# EAGLE design line_sensor (EAGLE 9.6.0)
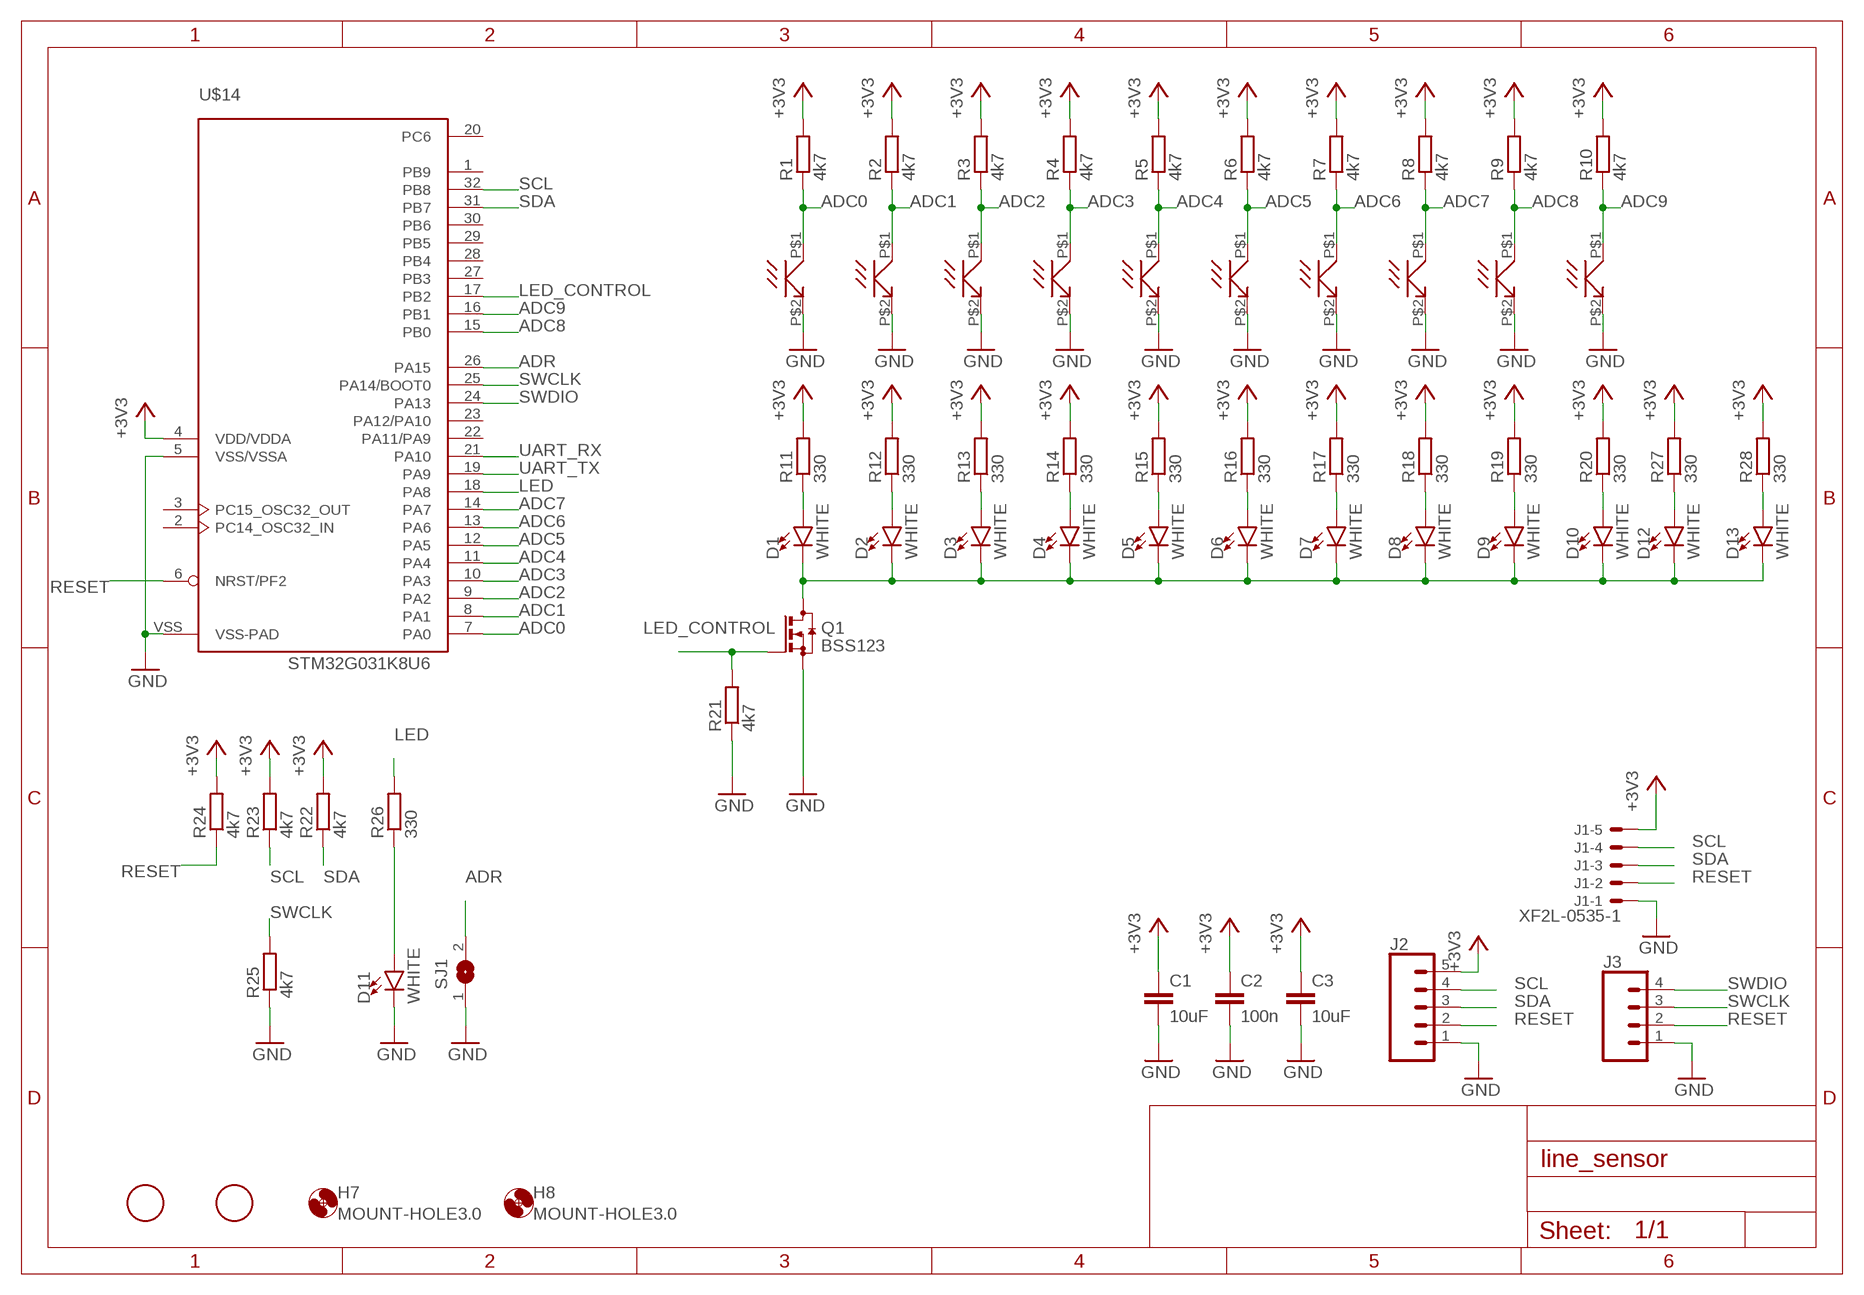
[diagram p0: schematic, sheet 1]

## Parts
C1  10uF  C-EUC0805K  [C0805K]
C2  100n  C-EUC0805K  [C0805K]
C3  10uF  C-EUC0805K  [C0805K]
D1  WHITE  LED-WHITE1206  [LED-1206]
D2  WHITE  LED-WHITE1206  [LED-1206]
D3  WHITE  LED-WHITE1206  [LED-1206]
D4  WHITE  LED-WHITE1206  [LED-1206]
D5  WHITE  LED-WHITE1206  [LED-1206]
D6  WHITE  LED-WHITE1206  [LED-1206]
D7  WHITE  LED-WHITE1206  [LED-1206]
D8  WHITE  LED-WHITE1206  [LED-1206]
D9  WHITE  LED-WHITE1206  [LED-1206]
D10  WHITE  LED-WHITE1206  [LED-1206]
D11  WHITE  LED-WHITE1206  [LED-1206]
D12  WHITE  LED-WHITE1206  [LED-1206]
D13  WHITE  LED-WHITE1206  [LED-1206]
H7  MOUNT-HOLE3.0  [3,0]
H8  MOUNT-HOLE3.0  [3,0]
J1  XF2L-0535-1  [XF2L-0535-1]
J2  CONN_05  [1X05]
J3  CONN_04LOCK  [1X04_LOCK]
Q1  BSS123  [SOT23]
R1  4k7  R-EU_M0805  [M0805]
R2  4k7  R-EU_M0805  [M0805]
R3  4k7  R-EU_M0805  [M0805]
R4  4k7  R-EU_M0805  [M0805]
R5  4k7  R-EU_M0805  [M0805]
R6  4k7  R-EU_M0805  [M0805]
R7  4k7  R-EU_M0805  [M0805]
R8  4k7  R-EU_M0805  [M0805]
R9  4k7  R-EU_M0805  [M0805]
R10  4k7  R-EU_M0805  [M0805]
R11  330  R-EU_M0805  [M0805]
R12  330  R-EU_M0805  [M0805]
R13  330  R-EU_M0805  [M0805]
R14  330  R-EU_M0805  [M0805]
R15  330  R-EU_M0805  [M0805]
R16  330  R-EU_M0805  [M0805]
R17  330  R-EU_M0805  [M0805]
R18  330  R-EU_M0805  [M0805]
R19  330  R-EU_M0805  [M0805]
R20  330  R-EU_M0805  [M0805]
R21  4k7  R-EU_M0805  [M0805]
R22  4k7  R-EU_M0805  [M0805]
R23  4k7  R-EU_M0805  [M0805]
R24  4k7  R-EU_M0805  [M0805]
R25  4k7  R-EU_M0805  [M0805]
R26  330  R-EU_M0805  [M0805]
R27  330  R-EU_M0805  [M0805]
R28  330  R-EU_M0805  [M0805]
SJ1  SJ  [SJ]
U$1  SFH3710  [SFH710]
U$2  SFH3710  [SFH710]
U$3  SFH3710  [SFH710]
U$4  SFH3710  [SFH710]
U$5  SFH3710  [SFH710]
U$6  SFH3710  [SFH710]
U$7  SFH3710  [SFH710]
U$8  SFH3710  [SFH710]
U$9  SFH3710  [SFH710]
U$10  SFH3710  [SFH710]
U$12  FIDUCIAL  [FIDUCIAL_1MM]
U$13  FIDUCIAL  [FIDUCIAL_1MM]
U$14  STM32G031K8U6  [UFQFPN32]

## Nets
+3V3: C1.1 C2.1 C3.1 J1.5 J2.5 R1.2 R2.2 R3.2 R4.2 R5.2 R6.2 R7.2 R8.2 R9.2 R10.2 R11.2 R12.2 R13.2 R14.2 R15.2 R16.2 R17.2 R18.2 R19.2 R20.2 R22.2 R23.2 R24.2 R27.2 R28.2 U$14.4(VDD/VDDA)
ADC0: R1.1 U$1.P$1(C) U$14.7(PA0)
ADC1: R2.1 U$2.P$1(C) U$14.8(PA1)
ADC2: R3.1 U$3.P$1(C) U$14.9(PA2)
ADC3: R4.1 U$4.P$1(C) U$14.10(PA3)
ADC4: R5.1 U$5.P$1(C) U$14.11(PA4)
ADC5: R6.1 U$6.P$1(C) U$14.12(PA5)
ADC6: R7.1 U$7.P$1(C) U$14.13(PA6)
ADC7: R8.1 U$8.P$1(C) U$14.14(PA7)
ADC8: R9.1 U$9.P$1(C) U$14.15(PB0)
ADC9: R10.1 U$10.P$1(C) U$14.16(PB1)
ADR: SJ1.2 U$14.26(PA15)
GND: C1.2 C2.2 C3.2 D11.C J1.1 J2.1 J3.1 Q1.2(S) R21.1 R25.1 SJ1.1 U$1.P$2(E) U$2.P$2(E) U$3.P$2(E) U$4.P$2(E) U$5.P$2(E) U$6.P$2(E) U$7.P$2(E) U$8.P$2(E) U$9.P$2(E) U$10.P$2(E) U$14.5(VSS/VSSA) U$14.VSS(VSS-PAD)
LED: R26.2 U$14.18(PA8)
LED_CONTROL: Q1.1(G) R21.2 U$14.17(PB2)
N$1: D1.A R11.1
N$2: D2.A R12.1
N$3: D3.A R13.1
N$4: D4.A R14.1
N$5: D5.A R15.1
N$6: D6.A R16.1
N$7: D7.A R17.1
N$8: D8.A R18.1
N$9: D9.A R19.1
N$10: D10.A R20.1
N$11: D1.C D2.C D3.C D4.C D5.C D6.C D7.C D8.C D9.C D10.C D12.C D13.C Q1.3(D)
N$12: D11.A R26.1
N$13: D12.A R27.1
N$14: D13.A R28.1
RESET: J1.2 J2.2 J3.2 R24.1 U$14.6(NRST/PF2)
SCL: J1.4 J2.4 R23.1 U$14.32(PB8)
SDA: J1.3 J2.3 R22.1 U$14.31(PB7)
SWCLK: J3.3 R25.2 U$14.25(PA14/BOOT0)
SWDIO: J3.4 U$14.24(PA13)
UART_RX: U$14.21(PA10)
UART_TX: U$14.19(PA9)
Unconnected: U$14.1(PB9) U$14.2(PC14_OSC32_IN) U$14.3(PC15_OSC32_OUT) U$14.20(PC6) U$14.22(PA11/PA9) U$14.23(PA12/PA10) U$14.27(PB3) U$14.28(PB4) U$14.29(PB5) U$14.30(PB6)

## Library data of the parts
C1-C3 = rcl:C-EU: CAPACITOR, European symbol; SPICEPREFIX: C
D1-D13 = SparkFun-LED:LED-WHITE: White SMD LED Used in manufacturing several products at SparkFun. Packages: 0603 - Bright White SMD 0603 package[Product Link] <http://www.kingbrightusa.com/product.asp?catalog_name=LED&product_id=APT1608QWF/D> 1206 - Bright White SMD1206 package [Product Link] <http://www.kingbrightusa.com/product.asp?catalog_name=LED&product_id=APT3216QWF/D> 3014 - Super Bright SMD 3014 package [Datasheet] <http://www.lumileds.com/uploads/459/DS208-pdf> SparkFun Products: Blackberry Trackballer Breakout <https://www.sparkfun.com/products/13169> Digital SandBox <https://www.sparkfun.com/products/12651>; PROD_ID: DIO-09955
H7 H8 = holes:MOUNT-HOLE: MOUNTING HOLE with drill center marker
J1 = con-omron:XF2*-05?: OMRON FPC Connector Source : http://www.omron.com/ecb/products/pdf/fpc.pdf; MPN: XF2L-0535-1A; OC_FARNELL: unknown; OC_NEWARK: 37M0863
J2 = SparkFun-Connectors:CONN_05: Multi connection point. Often used as Generic Header-pin footprint for 0.1 inch spaced/style header connections On any of the 0.1 inch spaced packages, you can populate with these: Break Away Headers - Straight <https://www.sparkfun.com/products/116> (PRT-00116) Break Away Male Headers - Right Angle <https://www.sparkfun.com/products/553> (PRT-00553) Female Headers <https://www.sparkfun.com/products/115> (PRT-00115) Break Away Headers - Machine Pin <https://www.sparkfun.com/products/117> (PRT-00117) Break Away Female Headers - Swiss Machine Pin <https://www.sparkfun.com/products/743> (PRT-00743) For SCREWTERMINALS and SPRING TERMINALS visit here: Screw Terimnals on SparkFun.com <https://www.sparkfun.com/search/results?term=Screw+Terminals> (5mm/3.5mm/2.54mm spacing) This device is also useful as a general connection point to wire up your design to another part of your project. Our various solder wires solder well into these plated through hole pads. Hook-Up Wire - Assortment (Stranded, 22 AWG) <https://www.sparkfun.com/products/11375> (PRT-11375) Hook-Up Wire - Assortment (Solid Core, 22 AWG) <https://www.sparkfun.com/products/11367> (PRT-11367) View the entire wire category on our website here <https://www.sparkfun.com/categories/141> Special notes: Molex polarized connector foot print use with SKU : PRT-08231 with associated crimp pins and housings. 1MM SMD Version SKU: PRT-10208
J3 = SparkFun-Connectors:CONN_04: Multi connection point. Often used as Generic Header-pin footprint for 0.1 inch spaced/style header connections On any of the 0.1 inch spaced packages, you can populate with these: Break Away Headers - Straight <https://www.sparkfun.com/products/116> (PRT-00116) Break Away Male Headers - Right Angle <https://www.sparkfun.com/products/553> (PRT-00553) Female Headers <https://www.sparkfun.com/products/115> (PRT-00115) Break Away Headers - Machine Pin <https://www.sparkfun.com/products/117> (PRT-00117) Break Away Female Headers - Swiss Machine Pin <https://www.sparkfun.com/products/743> (PRT-00743) For SCREWTERMINALS and SPRING TERMINALS visit here: Screw Terimnals on SparkFun.com <https://www.sparkfun.com/search/results?term=Screw+Terminals> (5mm/3.5mm/2.54mm spacing) This device is also useful as a general connection point to wire up your design to another part of your project. Our various solder wires solder well into these plated through hole pads. Hook-Up Wire - Assortment (Stranded, 22 AWG) <https://www.sparkfun.com/products/11375> (PRT-11375) Hook-Up Wire - Assortment (Solid Core, 22 AWG) <https://www.sparkfun.com/products/11367> (PRT-11367) View the entire wire category on our website here <https://www.sparkfun.com/categories/141> Special notes: Molex polarized connector foot print use with SKU : PRT-08231 with associated crimp pins and housings. 1MM SMD Version SKU: PRT-10208; PROD_ID: CONN-09696
Q1 = transistor-small-signal:BSS123: N-CHANNEL MOS FET
R1-R28 = rcl:R-EU_: RESISTOR, European symbol; SPICEPREFIX: R
SJ1 = jumper:SJ: SMD solder JUMPER
U$1-U$10 = my_library:SFH3710
U$12 U$13 = borkedlabs-misc:FIDUCIAL: For use by pick and place machines to calibrate the vision/machine, 1mm By microbuilder.eu
U$14 = my_library:STM32G031K8U6

## Board
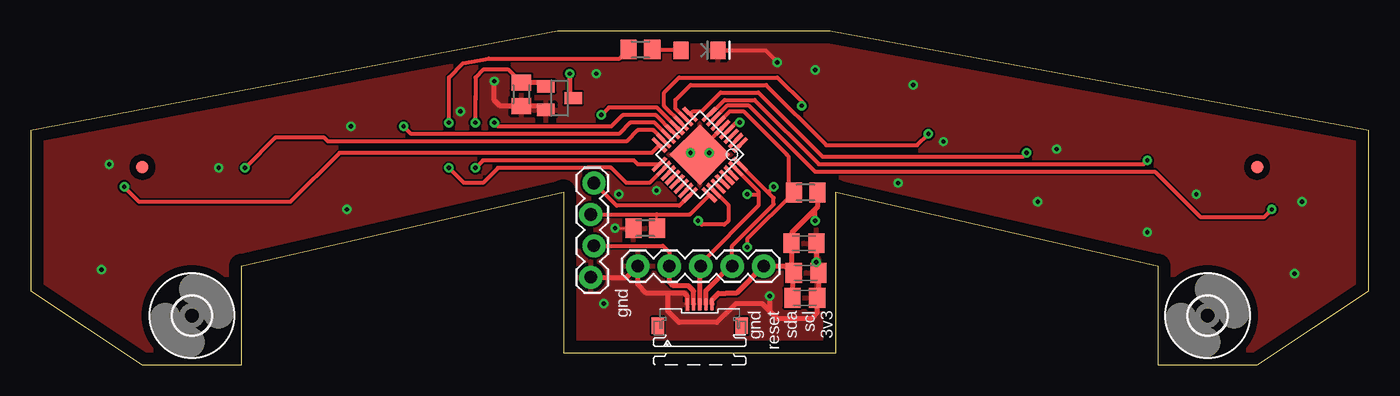
[diagram p1: board, top side]
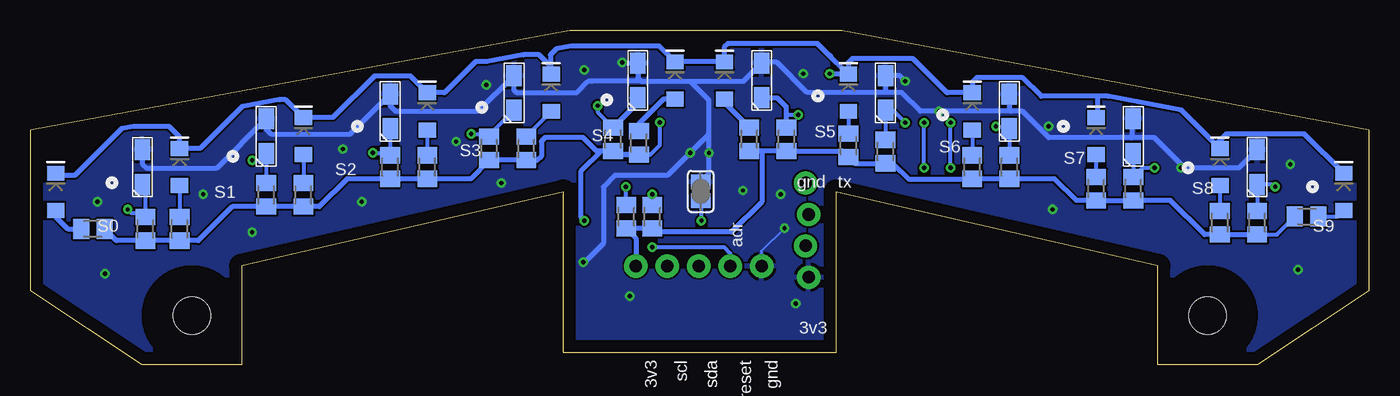
[diagram p2: board, bottom side, seen from below]

Size 108 x 27 mm. Coordinates in mm from the lower left corner, seen from the top.
Outline: 43,1 65,1 65,14 91,8 91,0 99,0 108,6 108,19 64.5,27 42.5,27 0,19 0,6 9,0 17,0 17,8 43,14 43,1
Copper layers (1*16): Top 0.035mm / dielectric 1.5mm / Bottom 0.035mm
Design rules "default": minimum track width 6mil, minimum drill 0.35mm, track to track 6mil, track to pad 6mil, pad to pad 6mil, via to via 6mil, smd to smd 6mil, copper to edge 40mil, drill to drill 6mil, minimum pad ring 10mil, minimum via ring 8mil, stop-mask expansion 4mil, vias tented up to drill 0mil, thermal gap 10mil

### Footprints (pad centres in the part's own frame; a part is rotated, then mirrored left to right if it is on the bottom)
C0805K = smd 1.3 x 1.6: 1 -1,0; 2 1,0
LED-1206 = smd 1.2 x 1.4: A -1.5,0; C 1.5,0
3,0 = hole 3: 0,0
XF2L-0535-1 = smd 1 x 0.25: 1 1.905,1; 2 1.905,0.5; 3 1.905,0; 4 1.905,-0.5; 5 1.905,-1 | smd 1.34 x 1: M1 0.18,3.388; M2 0.18,-3.388
1X05 = drill 1.016 pad 1.88: 1 0,0; 2 2.54,0; 3 5.08,0; 4 7.62,0; 5 10.16,0
1X04_LOCK = drill 1.016 pad 1.88: 1 0,0.127; 2 2.54,-0.127; 3 5.08,0.127; 4 7.62,-0.127
SOT23 = smd 1 x 1.4: 1 -0.95,-1.1; 2 0.95,-1.1; 3 0,1.1
M0805 = smd 1.3 x 1.6: 1 -0.95,0; 2 0.95,0
SJ = smd 1.168 x 1.6: 1 -0.762,0; 2 0.762,0
SFH710 = smd 1.7 x 1.25: P$1 -1.4,0; P$2 1.4,0
FIDUCIAL_1MM = smd 1 x 1: 1 0,0
UFQFPN32 = smd 1.5 x 0.3: 1 -2.85,1.75; 2 -2.85,1.25; 3 -2.85,0.75; 4 -2.85,0.25; 5 -2.85,-0.25; 6 -2.85,-0.75; 7 -2.85,-1.25; 8 -2.85,-1.75; 17 2.85,-1.75; 18 2.85,-1.25; 19 2.85,-0.75; 20 2.85,-0.25; 21 2.85,0.25; 22 2.85,0.75; 23 2.85,1.25; 24 2.85,1.75 | smd 0.3 x 1.5: 9 -1.75,-2.85; 10 -1.25,-2.85; 11 -0.75,-2.85; 12 -0.25,-2.85; 13 0.25,-2.85; 14 0.75,-2.85; 15 1.25,-2.85; 16 1.75,-2.85; 25 1.75,2.85; 26 1.25,2.85; 27 0.75,2.85; 28 0.25,2.85; 29 -0.25,2.85; 30 -0.75,2.85; 31 -1.25,2.85; 32 -1.75,2.85 | smd 3.45 x 3.45: VSS 0,0

### Placement (x,y rotation side)
C1  62.59,7.45 0 top
C2  62.41,9.84 0 top
C3  62.48,5.42 0 top
D1  96,16 90 bottom
D2  86,18.5 90 bottom
D3  76,20.5 90 bottom
D4  66,22 90 bottom
D5  56,23 90 bottom
D6  52,23 90 bottom
D7  42,22 90 bottom
D8  32,20.5 90 bottom
D9  22,18.5 90 bottom
D10  12,16 90 bottom
D11  53.99,25.43 0 top
D12  106,14 90 bottom
D13  2,14 90 bottom
H7  95,4 0 top
H8  13,4 0 top
J1  54,3 90 top
J2  49,8 0 top
J3  45.33,7.09 90 top
Q1  42.68,21.57 270 top
R1  98.75,11 270 bottom
R2  89,13.75 270 bottom
R3  79,16 270 bottom
R4  71,17.5 270 bottom
R5  61,18.25 270 bottom
R6  47,18.25 270 bottom
R7  39,17.25 270 bottom
R8  29,16 270 bottom
R9  19,14.25 270 bottom
R10  9,11.5 270 bottom
R11  96,11 270 bottom
R12  86,13.75 270 bottom
R13  76,16 270 bottom
R14  68,17.5 270 bottom
R15  58.91,17.95 270 bottom
R16  50,18.25 270 bottom
R17  42,17.75 270 bottom
R18  32,16 270 bottom
R19  22,14.25 270 bottom
R20  12,11.5 270 bottom
R21  39.59,21.88 90 top
R22  57.84,11.99 270 bottom
R23  59.94,11.99 270 bottom
R24  62.54,13.94 0 top
R25  49.6,11.05 0 top
R26  49.21,25.5 180 top
R27  103,11 0 bottom
R28  5,12 180 bottom
SJ1  53.92,14.03 270 bottom
U$1  99,16 90 bottom
U$2  89,18.5 90 bottom
U$3  79,20.5 90 bottom
U$4  69,22 90 bottom
U$5  59,23 90 bottom
U$6  49,23 90 bottom
U$7  39,22 90 bottom
U$8  29,20.5 90 bottom
U$9  19,18.5 90 bottom
U$10  9,16 90 bottom
U$12  9,16 0 top
U$13  99,16 0 top
U$14  54,17 225 top

### Tracks (layer width: path | path; a pad name or v marks a point on that pad's centre or on a via)
+3V3  (via drill 0.35)
  Top 0.305: J2.5 59.36,8.2 | U$14.4 56.94,19.59 57.22,19.59 v57.24,19.61
  Top 0.406: J1.5 55,5.28 55.51,5.79 56.12,5.79 56.95,5.79 J2.5 60.88,8 61.51,7.37 | 61.51,7.37 C1.1 61.41,7.63 C2.1 61.41,10.67 63.47,12.73 | 61.51,7.37 61.48,7.34 C3.1 | R24.2 63.49,12.76 63.47,12.73 | v63.31,11.66 63.31,12.58 63.47,12.73
  Bottom 0.305: R10.2 7.4,10.55 R28.2 | 41.5,16.3 R17.2 | v57.24,19.61 57.24,17.74 57.98,16.99 R15.2
  Bottom 0.406: R10.2 R20.2 13.23,10.55 15.98,13.3 R9.2 R19.2 23.61,13.3 25.36,15.05 R8.2 R18.2 32.04,15.01 37.1,15.01 38.39,16.3 R7.2 41.5,16.3 R17.2 42.5,17.3 R6.2 R16.2 | R5.2 60.7,16.99 R15.2 60.91,16.99 | 67.4,16.55 R14.2 | R14.2 R4.2 72.5,15.05 R13.2 | 76.11,15.16 R13.2 | R5.2 62.35,17.3 63.44,18.38 66.48,18.38 66.79,18.08 66.79,16.86 67.1,16.55 R14.2 | 50.47,17.3 R16.2 | R13.2 R3.2 82.48,15.05 84.73,12.8 R12.2 R2.2 91.74,12.8 94.49,10.05 R11.2 R1.2 101.1,10.05 R27.2 | J2.5 59.16,10.26 R23.2 R22.2 57.55,10.75 51.43,10.75 48.99,13.19 48.99,17.3 R16.2 | 61,17.04 R5.2 | R5.2 61.94,17.3 63.62,15.62 63.62,11.97 v63.31,11.66
ADC0  (via drill 0.35)
  Top 0.305: v100.19,12.58 99.58,11.97 94.4,11.97 90.75,15.62 63.31,15.62 61.64,17.3 57.98,20.96 56.19,20.96 U$14.7
  Bottom 0.305: 99.54,14.06 U$1.P$1 98.75,14.35 98.75,12.27 | R1.1 98.75,12.27 | v100.19,12.58 99.89,12.27 98.75,12.27
ADC1  (via drill 0.35)
  Top 0.305: U$14.8 54.84,20.25 56,21.41 58.44,21.41 63.62,16.23 89.83,16.23 v90.14,16.54
  Bottom 0.305: U$2.P$1 89,16.84 | 89,16.84 R2.1 | v90.14,16.54 89.31,16.54 89,16.84
  Bottom 0.406: 89,15.03 R2.1
ADC2  (via drill 0.35)
  Top 0.305: U$14.9 53.47,20.5 54.17,20.5 55.69,22.02 58.74,22.02 63.92,16.84 80.08,16.84 v80.38,17.15
  Bottom 0.305: R3.1 79.09,16.86 R3.1 | U$3.P$1 79,17.15 | 79,17.15 R3.1 | v80.38,17.15 79,17.15
ADC3  (via drill 0.35)
  Top 0.305: U$14.10 52.03,20.73 52.03,21.41 53.25,22.63 59.35,22.63 64.23,17.76 71.54,17.76 v72.46,18.67
  Bottom 0.305: R4.1 71.07,18.38 71.07,18.53 70.93,18.67 | U$4.P$1 70.93,18.67 | v72.46,18.67 v72.45,18.67 70.93,18.67
ADC4  (via drill 0.35)
  Top 0.305: U$14.11 51.12,20.94 51.12,22.02 52.34,23.24 60.27,23.24 62.4,21.11 v62.25,20.96
  Bottom 0.305: 59.53,21.6 U$5.P$1 | v62.25,20.96 62.25,20.45 R5.1
  Bottom 0.406: U$5.P$1 59,21.2 R5.1
ADC5  (via drill 0.35)
  Top 0.305: U$14.12 50.55,20.81 46.66,20.81 v46.06,20.21
  Bottom 0.305: v46.06,20.21 47,20.21
  Bottom 0.406: R6.1 47,20.21 47,20.85 47.75,21.6 U$6.P$1
ADC6  (via drill 0.35)
  Top 0.305: U$14.13 50.45,20.2 47.77,20.2 46.85,19.28 37.71,19.28 v37.41,19.59
  Bottom 0.305: R7.1 U$7.P$1 38.42,20.6 v37.41,19.59
ADC7  (via drill 0.35)
  Top 0.305: U$14.14 50.35,19.59 48.38,19.59 47.46,18.67 30.7,18.67 v30.09,19.28
  Bottom 0.305: R8.1 U$8.P$1 29.18,19.28 v30.09,19.28
ADC8  (via drill 0.35)
  Top 0.305: U$14.15 50.26,18.98 48.99,18.98 48.07,18.06 23.99,18.06 23.69,18.37 19.73,18.37 v17.29,15.93
  Bottom 0.305: U$9.P$1 R9.1 18.27,15.93 v17.29,15.93
ADC9  (via drill 0.35)
  Top 0.305: U$14.16 50.12,17.15 24.91,17.15 20.95,13.19 8.75,13.19 v7.53,14.41
  Bottom 0.305: v7.53,14.41 7.73,14.6 U$10.P$1 R10.1
ADR  (via drill 0.35)
  Top 0.305: U$14.26 56.3,12.93 56.3,11.66 56,11.36 54.17,11.36 v53.86,11.66
  Bottom 0.305: v53.86,11.66 53.86,13.21 SJ1.2
GND  (via drill 0.35)
  Top 0.203: R25.1 v47.16,11.05
  Top 0.305: U$14.5 54,17.35 U$14.VSS | D11.C 59.3,25.43 v60.27,24.46
  Top 0.406: J1.1 53,5.56 52.77,5.79 51.43,5.79 | 51.43,5.79 50.02,5.79 49.72,5.79 49,6.51 J2.1 48.09,7.09 J3.1 | U$14.VSS 53.4,17 v53.25,17.15 | C2.2 v63.41,8.31 63.41,7.63 C1.2 63.59,5.53 C3.2 63.48,4.21 63.01,3.74 60.27,3.74 59.66,4.35 | 59.66,4.35 59.05,4.96 56.91,4.96 55.39,3.43 52.34,3.43 51.43,4.35 51.43,5.79 | 59.66,4.35 v59.66,5.57 | Q1.2 41.27,20.93 R21.1 37.89,20.93 37.41,21.41 v37.41,22.94
  Bottom 0.203: v47.16,11.05 49,9.21 J2.1
  Bottom 0.305: v60.27,24.46 60.2,24.4 U$5.P$2
  Bottom 0.406: 79.11,21.79 U$3.P$2 | U$4.P$2 69,23.98 | U$10.P$2 10.47,15.93 14.85,15.93 17.29,18.37 19.12,18.37 | U$9.P$2 19.12,19.78 19.12,18.37 | 19.12,18.37 25.82,18.37 27.96,20.5 28.87,20.5 | U$8.P$2 29,20.63 28.87,20.5 | 38.93,22.02 37.71,22.02 36.19,20.5 28.87,20.5 | 38.93,22.02 39,22.1 U$7.P$2 37.87,23.4 v37.41,22.94 | 38.93,22.02 45.33,22.02 47.77,24.46 48.94,24.46 U$6.P$2 50.46,22.94 54.78,22.94 | U$5.P$2 59,23.2 58.74,22.94 | 58.74,22.94 57.22,22.94 54.78,22.94 | U$4.P$2 69,22.23 68.8,22.02 63.92,22.02 63.01,22.94 | 58.74,22.94 62.7,22.94 | 62.7,22.94 63.01,22.94 | 62.7,22.94 63.01,22.94 | U$3.P$2 79,20.95 78.55,20.5 71.9,20.5 U$4.P$2 | U$1.P$2 99,16.26 98.67,15.93 92.97,15.93 U$2.P$2 89,19.06 88.61,18.67 82.23,18.67 U$3.P$2 | 53.25,18.67 v53.25,17.15 53.25,15.46 SJ1.1 | 53.25,18.67 53.25,21.41 54.78,22.94 | 53.25,18.67 v54.78,17.15 56.61,15.32 60.87,15.32 61.79,14.41 61.79,9.83 63.31,8.31 v63.41,8.31
  other vias: 25.52,12.58 25.82,19.28 5.71,7.7 6.32,16.23 15.15,15.93 45.63,23.55 46.24,4.96 73.68,18.06 70.02,14.71 63.31,23.85 82.82,17.45 94.1,13.8 102.63,13.19 102.02,7.39 90.14,10.75 81.3,13.19 34.66,20.5 71.24,22.63 50.51,14.1 47.46,13.8
  pour Bottom: -3.44,52.81 118.79,52.81 118.79,-24.91 -3.44,-24.91
  pour Top: -11.06,59.52 119.09,59.52 119.09,-20.04 -11.06,-20.04
LED  (via drill 0.35)
  Top 0.305: U$14.18 49.94,14.71 48.07,14.71 46.83,15.95 44.94,15.95 44.92,15.93 37.71,15.93 36.49,14.71 34.97,14.71 v33.75,15.93 | v33.75,19.59 33.75,23.24 34.88,24.38 36.96,24.77 47.53,24.77 R26.2
  Bottom 0.305: v33.75,15.93 v33.75,19.59
LED_CONTROL  (via drill 0.35)
  Top 0.305: R21.2 38.56,23.85 36.49,23.85 35.88,23.24 35.88,21.72 | 35.88,21.72 35.88,21.41 | U$14.17 49,16.22 48.68,16.54 36.49,16.54 v35.88,15.93 | v35.88,19.59 35.88,21.72
  Top 0.406: R21.2 41.27,22.83 Q1.1
  Bottom 0.305: v35.88,15.93 v35.88,19.59
N$1
  Bottom 0.305: D1.A R11.1
N$2
  Bottom 0.305: D2.A R12.1
N$3
  Bottom 0.305: D3.A R13.1
N$4
  Bottom 0.305: D4.A 68,18.5 R14.1
N$5
  Bottom 0.406: D5.A 56.92,21.5 58.91,19.51 R15.1
N$6
  Bottom 0.406: D6.A 52,21.2 R16.1
N$7
  Bottom 0.305: D7.A R17.1
N$8
  Bottom 0.305: D8.A R18.1
N$9
  Bottom 0.305: D9.A R19.1
N$10
  Bottom 0.305: D10.A R20.1
N$11  (via drill 0.35)
  Top 0.406: Q1.3 43.5,21.85 v43.5,23.55
  Bottom 0.406: D8.C 32.21,21.79 | 75.6,21.6 D3.C | D13.C 5.17,18.67 11.5,18.67 12.11,18.06 12.11,17.61 D10.C 15.1,20.6 21.04,21.72 21.86,21.72 | D8.C 32,22.86 31.61,23.24 27.96,23.24 26.43,21.72 21.86,21.72 | D9.C 21.86,20.14 21.86,21.72 | D8.C 34.03,22 36.8,24.77 38.62,24.77 41.67,24.77 42,24.44 D7.C | D7.C 42.28,23.78 42.28,23.55 v43.5,23.55 | 43.38,24.88 43.84,25.34 | 43.84,25.34 44.49,25.99 51.73,25.99 52.03,25.68 52.03,24.53 D6.C D5.C 57.28,25.78 63.62,25.78 64.39,25.78 65.56,25.56 66.06,25.07 66.06,23.56 D4.C 66,24.1 66.97,25.07 68.24,25.07 71.19,24.53 72.09,24.53 74.61,22 D3.C | D3.C 77.36,23.36 80.27,23.36 83.63,20 D2.C 87.45,21.45 87.95,21.45 90.96,20.89 94.36,17.5 D1.C 96,18.44 96.84,19.28 99.73,19.28 100.67,19.11 104.46,15.32 105.82,15.32 D12.C | 43.84,25.34 D7.C
N$12
  Top 0.305: R26.1 52.42,25.5 D11.A
N$13
  Bottom 0.406: D12.A 106,11.98 105.02,11 R27.1
N$14
  Bottom 0.305: R28.1 2.5,12 D13.A
RESET  (via drill 0.35)
  Top 0.305: U$14.6 56.44,20.5 57.52,20.5 61.03,17 61.18,16.84 61.18,14.35 R24.1 57.83,10.17 v57.83,9.53 | J3.2 51.02,9.63 51.54,9.11 J2.2
  Top 0.406: J1.2 53.5,5.97 53.07,6.4 51.85,6.4 51.54,6.71 51.54,7.62 J2.2
  Bottom 0.305: v57.83,9.53 52.03,9.53 51.54,9.03 J2.2
SCL  (via drill 0.35)
  Top 0.305: 56.39,8 56.5,8 | U$14.32 59.52,13.96 | 59.52,13.96 59.96,13.52 59.96,12.98 56.62,9.64 J2.4 | v59.96,14.41 59.52,13.96 | 59.52,13.96
  Top 0.406: J1.4 54.5,6 56.5,8 J2.4
  Bottom 0.305: R23.1 59.96,12.96 v59.96,14.41
SDA  (via drill 0.35)
  Top 0.305: J2.3 53.99,8.09 | 53.99,7.93 54,7.92 54,8.14 58.74,12.88 58.74,13.8 | U$14.31 58.74,14.03 58.74,13.8 | v57.83,13.8 58.74,13.8
  Top 0.406: J1.3 54,7.92 J2.3
  Bottom 0.305: R22.1 57.84,13.78 v57.83,13.8
SWCLK
  Top 0.203: R25.2 50.51,11.09 50.51,12.17
  Top 0.305: J3.3 50.51,12.17 53.2,12.17 U$14.25
SWDIO
  Top 0.305: U$14.24 52.36,12.88 47.28,12.88 J3.4

### Text on the board
tNames: gnd | gnd | reset | sda | scl | 3v3
bNames: S5 | S4 | S6 | S3 | S7 | tx | gnd | S2 | S8 | S1 | S9 | S0 | adr | 3v3 | gnd | reset | sda | scl | 3v3 | gnd | reset | sda | scl | 3v3
tTest: SWDIO | SWCLK | GND | RESET | GND | RESET | SDA | SCL | 3V3
Measures: r = 150.00